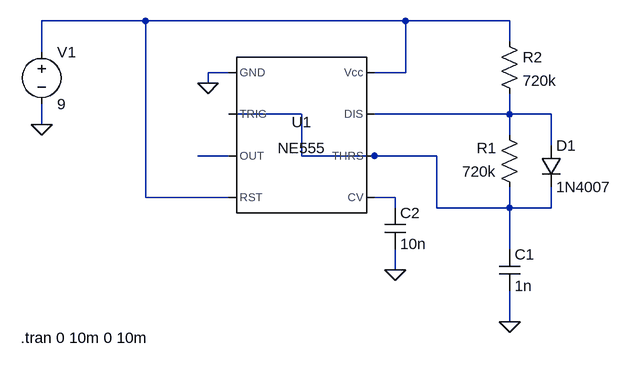
[diagram p0: schematic circuit oscilateur.asc]
circuit oscilateur.asc, the LTspice schematic file:
Version 4.1
SHEET 1 880 680
WIRE -32 -32 -192 -32
WIRE 368 -32 -32 -32
WIRE 528 -32 368 -32
WIRE 528 0 528 -32
WIRE -192 16 -192 -32
WIRE 96 48 64 48
WIRE 368 48 368 -32
WIRE 368 48 320 48
WIRE 64 64 64 48
WIRE 208 112 96 112
WIRE 528 112 528 80
WIRE 528 112 320 112
WIRE 592 112 528 112
WIRE -192 128 -192 96
WIRE 528 144 528 112
WIRE 592 160 592 112
WIRE 96 176 48 176
WIRE 208 176 208 112
WIRE 320 176 208 176
WIRE 416 176 320 176
WIRE -32 240 -32 -32
WIRE 96 240 -32 240
WIRE 352 240 320 240
WIRE 352 256 352 240
WIRE 416 256 416 176
WIRE 528 256 528 224
WIRE 528 256 416 256
WIRE 592 256 592 224
WIRE 592 256 528 256
WIRE 528 320 528 256
WIRE 352 352 352 320
WIRE 528 432 528 384
FLAG 64 64 0
FLAG -192 128 0
FLAG 352 352 0
FLAG 528 432 0
SYMBOL Misc\\NE555 208 144 R0
SYMATTR InstName U1
SYMBOL voltage -192 0 R0
WINDOW 123 0 0 Left 0
WINDOW 39 0 0 Left 0
SYMATTR InstName V1
SYMATTR Value 9
SYMBOL res 544 240 R180
WINDOW 0 36 76 Left 2
WINDOW 3 36 40 Left 2
SYMATTR InstName R1
SYMATTR Value 720k
SYMBOL cap 512 320 R0
SYMATTR InstName C1
SYMATTR Value 1n
SYMBOL cap 336 256 R0
SYMATTR InstName C2
SYMATTR Value 10n
SYMBOL res 512 -16 R0
SYMATTR InstName R2
SYMATTR Value 720k
SYMBOL diode 576 160 R0
SYMATTR InstName D1
SYMATTR Value 1N4007
TEXT -224 456 Left 2 !.tran 0 10m 0 10m

The netlist it stands for:
* circuit oscilateur.asc
X§U1 0 N002 N004 N001 N005 N002 N003 N001 NE555  ; pins GND TRIG OUT RST CV THRS DIS Vcc
V1 N001 0 9
R1 N002 N003 720k
C1 N002 0 1n
C2 N005 0 10n
R2 N001 N003 720k
D1 N003 N002 1N4007
.model D D
.lib standard.dio
.tran 0 10m 0 10m
.lib NE555.sub
.backanno
.end